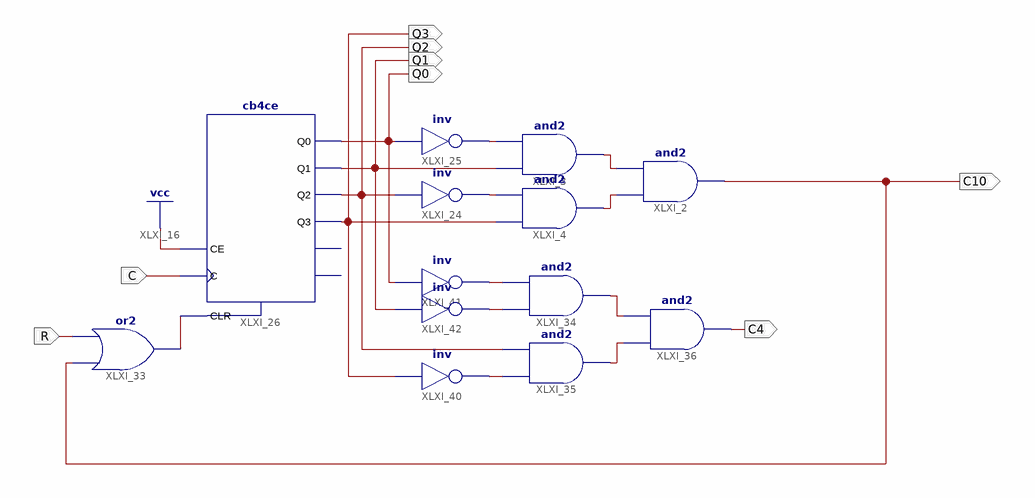
[diagram p0: schematic sheet 1]
// Xilinx ISE schematic unidadHora.sch (spartan3e) as structural Verilog: 13 symbols, 8 ports
module unidadHora (
  input  C,
  input  R,
  output C10,
  output Q1,
  output Q2,
  output Q3,
  output Q0,
  output C4
);

  wire XLXN_3, XLXN_4, XLXN_42, XLXN_43, XLXN_57, XLXN_58, XLXN_62, XLXN_63, XLXN_64;

  and XLXI_2 (C10, XLXN_4, XLXN_3);
  and XLXI_3 (XLXN_3, Q1, XLXN_43);
  and XLXI_4 (XLXN_4, Q3, XLXN_42);
  not XLXI_24 (XLXN_42, Q2);
  not XLXI_25 (XLXN_43, Q0);
  cb4ce XLXI_26 (.C(C), .CE(1'b1), .CLR(C10), .Q0(Q0), .Q1(Q1), .Q2(Q2), .Q3(Q3));  // open: CEO, TC
  or XLXI_33 (C10, C10, R);
  and XLXI_34 (XLXN_57, XLXN_64, XLXN_63);
  and XLXI_35 (XLXN_58, XLXN_62, Q2);
  and XLXI_36 (C4, XLXN_58, XLXN_57);
  not XLXI_40 (XLXN_62, Q3);
  not XLXI_41 (XLXN_63, Q0);
  not XLXI_42 (XLXN_64, Q1);
endmodule
